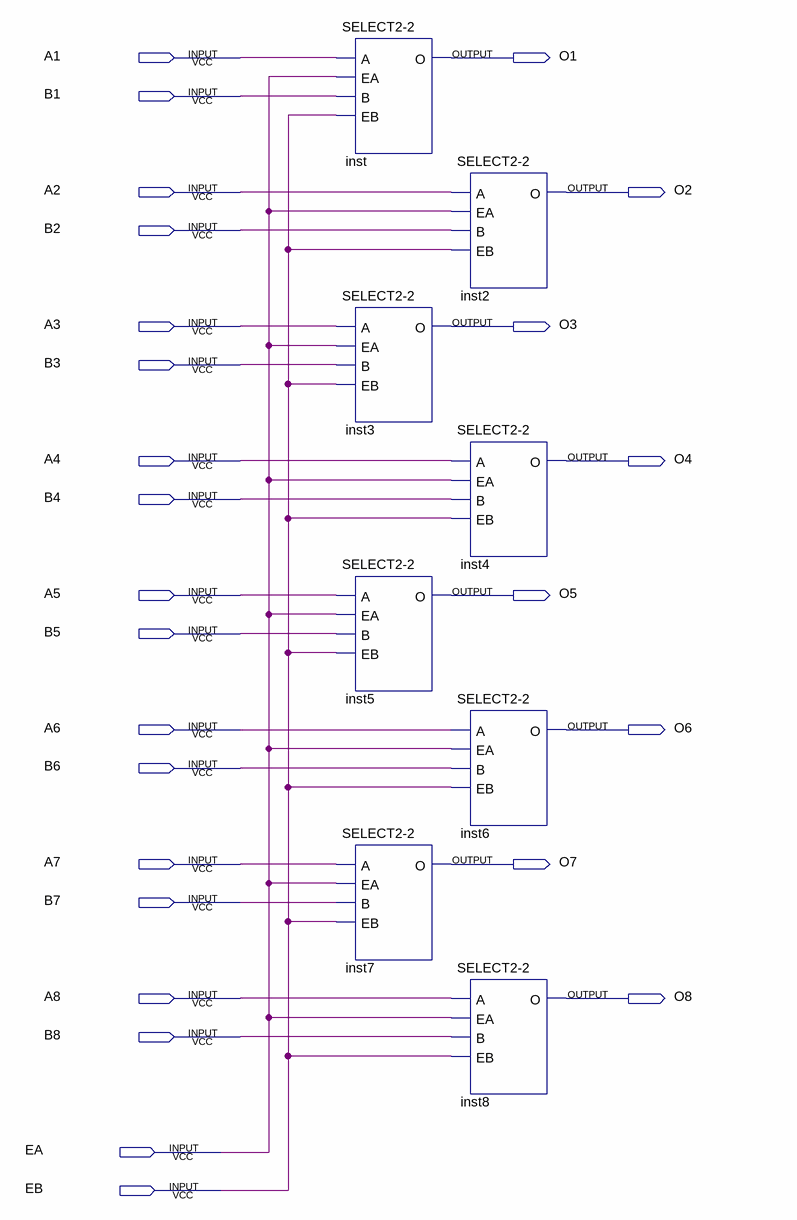
[diagram p0: schematic sheet]
// Quartus schematic SELECT2-8.bdf as structural Verilog: 8 symbols, 26 pins
module \SELECT2-8  (
  input  A1,
  input  B1,
  input  A2,
  input  B2,
  input  A3,
  input  B3,
  input  A4,
  input  B4,
  input  A5,
  input  B5,
  input  A6,
  input  B6,
  input  A7,
  input  B7,
  input  A8,
  input  B8,
  input  EA,
  input  EB,
  output O1,
  output O2,
  output O3,
  output O4,
  output O5,
  output O6,
  output O7,
  output O8
);

  \SELECT2-2  inst (.A(A1), .EA(EA), .B(B1), .EB(EB), .O(O1));
  \SELECT2-2  inst3 (.A(A3), .EA(EA), .B(B3), .EB(EB), .O(O3));
  \SELECT2-2  inst5 (.A(A5), .EA(EA), .B(B5), .EB(EB), .O(O5));
  \SELECT2-2  inst7 (.A(A7), .EA(EA), .B(B7), .EB(EB), .O(O7));
  \SELECT2-2  inst2 (.A(A2), .EA(EA), .B(B2), .EB(EB), .O(O2));
  \SELECT2-2  inst4 (.A(A4), .EA(EA), .B(B4), .EB(EB), .O(O4));
  \SELECT2-2  inst6 (.A(A6), .EA(EA), .B(B6), .EB(EB), .O(O6));
  \SELECT2-2  inst8 (.A(A8), .EA(EA), .B(B8), .EB(EB), .O(O8));
endmodule
